# EAGLE design box (EAGLE 8.3.1)
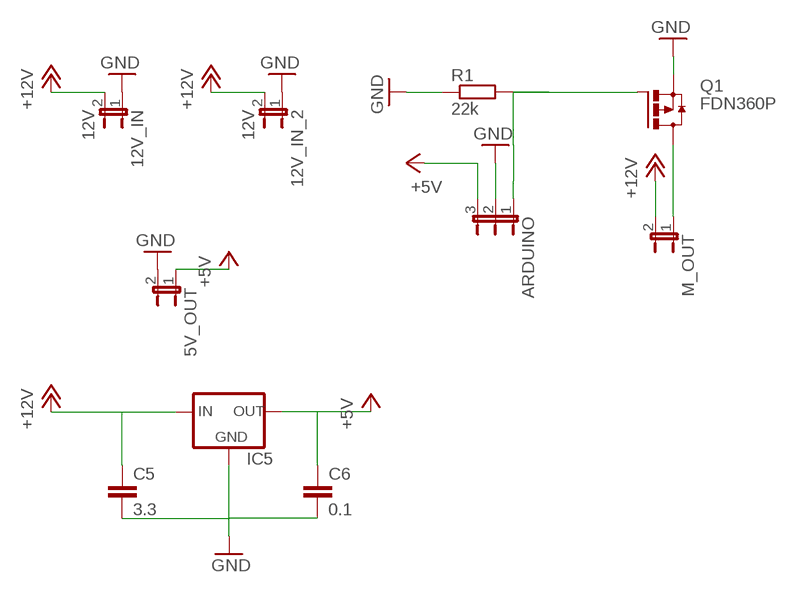
[diagram p0: schematic, sheet 1]

## Parts
5V_OUT  JP1E  [JP1]
12V_IN  12V  JP1E  [JP1]
12V_IN_2  12V  JP1E  [JP1]
ARDUINO  JP2E  [JP2]
C5  3.3  C-EU025-024X044  [C025-024X044]
C6  0.1  C-EU025-024X044  [C025-024X044]
IC5  78XXL  [78XXL]
M_OUT  JP1E  [JP1]
Q1  FDN360P  [SUPER-SOT3]
R1  22k  R-EU_0204/7  [0204/7]

## Nets
+5V: 5V_OUT.1 ARDUINO.3 C6.1 IC5.OUT
+12V: 12V_IN.2 12V_IN_2.2 C5.1 IC5.IN M_OUT.2
GND: 5V_OUT.2 12V_IN.1 12V_IN_2.1 ARDUINO.2 C5.2 C6.2 IC5.GND Q1.2(S) R1.1
N$1: M_OUT.1 Q1.3(D)
N$2: ARDUINO.1 Q1.1(G) R1.2

## Library data of the parts
5V_OUT 12V_IN 12V_IN_2 M_OUT = jumper:JP1E: JUMPER
ARDUINO = jumper:JP2E: JUMPER
C5 C6 = rcl:C-EU: CAPACITOR, European symbol
IC5 = v-reg:78XXL: VOLTAGE REGULATOR
Q1 = transistor-power:FDN360P: Single P-Channel, PowerTrench (R) MOSFET Source: http://www.fairchildsemi.com/ds/FD/FDN360P.pdf
R1 = rcl:R-EU_: RESISTOR, European symbol

## Net classes
0 default: clearance 0.205 mm

## Board
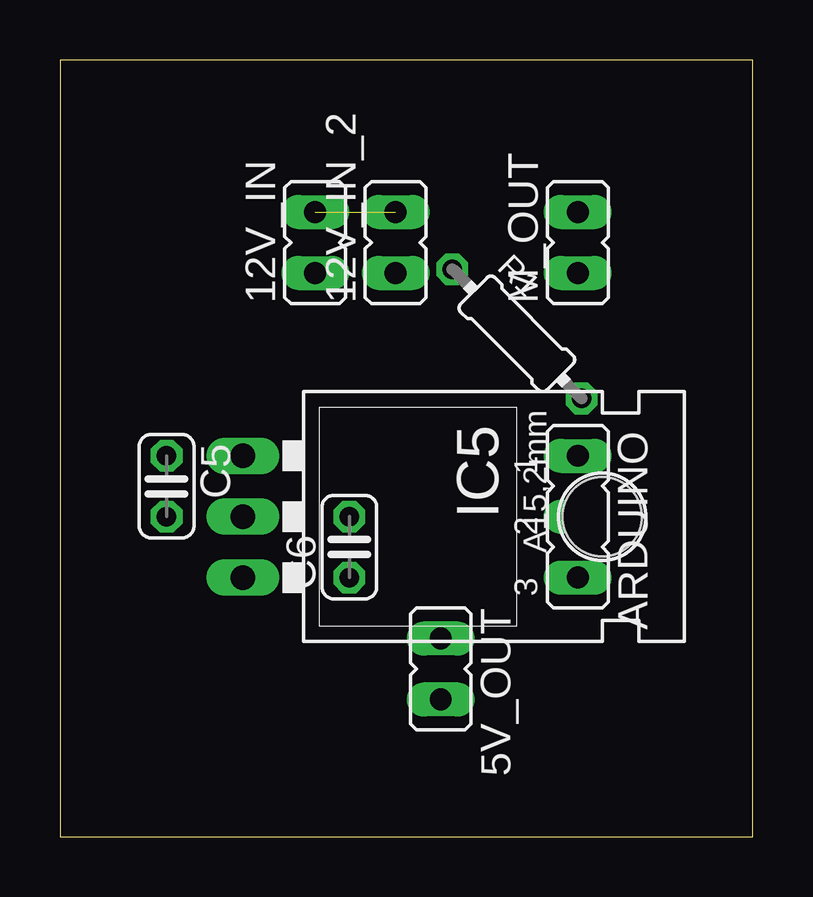
[diagram p1: board, top side]
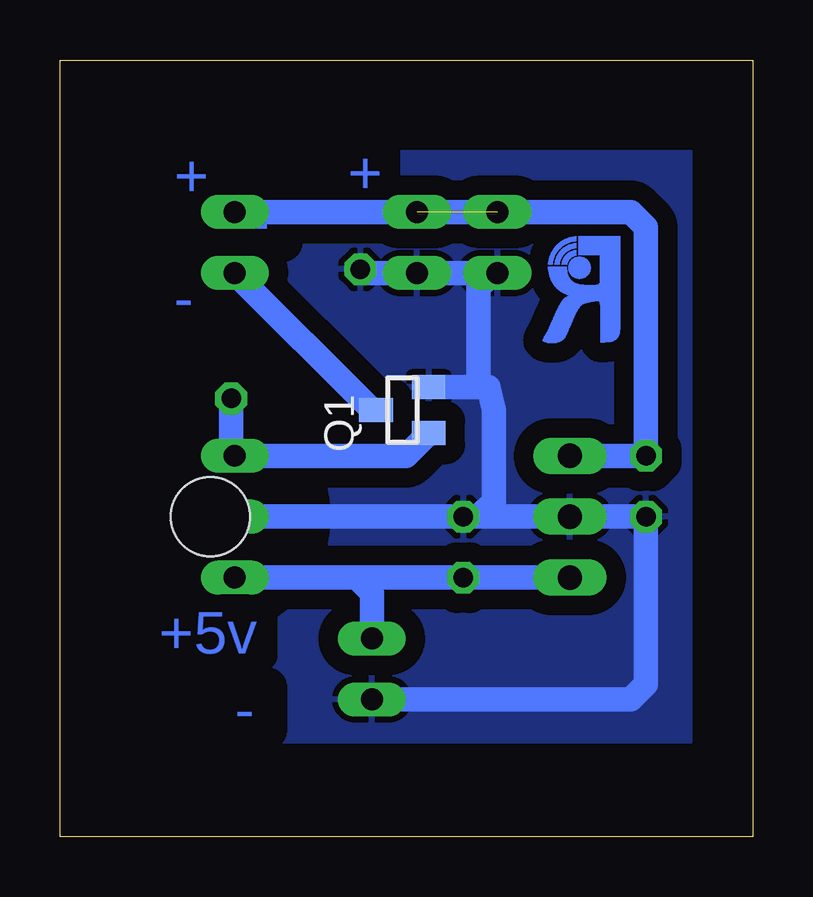
[diagram p2: board, bottom side, seen from below]

Size 28.88 x 32.38 mm. Coordinates in mm from the lower left corner, seen from the top.
Outline: 0,0 28.88,0 28.88,32.38 0,32.38 0,0
Copper layers (1*16): Top 0.035mm / dielectric 1.5mm / Bottom 0.035mm
Design rules "default": minimum track width 10mil, minimum drill 24mil, track to track 8mil, track to pad 8mil, pad to pad 8mil, via to via 8mil, smd to smd 8mil, copper to edge 40mil, drill to drill 8mil, minimum pad ring 10mil, minimum via ring 8mil, stop-mask expansion 4mil, vias tented up to drill 0mil, thermal gap 10mil

### Footprints (pad centres in the part's own frame; a part is rotated, then mirrored left to right if it is on the bottom)
JP1 = drill 0.914 long: 1 0,-1.27; 2 0,1.27
JP2 = drill 0.914 long: 1 -2.54,0; 2 0,0; 3 2.54,0
C025-024X044 = drill 0.813 octagon: 1 -1.27,0; 2 1.27,0
78XXL = drill 1.016 long: GND 0,-3.81; IN -2.54,-3.81; OUT 2.54,-3.81 | hole 3.302: 0,11.176
SUPER-SOT3 = smd 1 x 1.4: 1 -0.95,-1.1; 2 0.95,-1.1; 3 0,1.1
0204/7 = drill 0.813 octagon: 1 -3.81,0; 2 3.81,0

### Placement (x,y rotation side)
5V_OUT  15.87,6.99 180 top
12V_IN  10.64,24.77 0 top
12V_IN_2  14,24.77 0 top
ARDUINO  21.59,13.33 270 top
C5  4.45,14.6 270 top
C6  12.06,12.06 90 top
IC5  11.43,13.33 270 top
M_OUT  21.59,24.77 0 top
Q1  14.6,17.78 90 bottom
R1  19.05,20.96 315 top

### Tracks (layer width: path | path; a pad name or v marks a point on that pad's centre or on a via)
+5V
  Bottom 1.016: IC5.OUT C6.1 16.51,10.79 | ARDUINO.3 16.51,10.79 | 5V_OUT.1 15.87,10.16 16.51,10.79
+12V  (1 unrouted)
  Bottom 1.016: M_OUT.2 12V_IN.2 5.08,26.04 4.45,25.4 C5.1 IC5.IN
GND
  Bottom 1.016: ARDUINO.2 C6.2 | 11.43,18.74 11.02,18.74 10.79,17.78 10.79,13.97 11.43,13.33 C6.2 | 11.43,18.74 Q1.2 | C6.2 IC5.GND C5.2 4.45,6.35 5.08,5.71 5V_OUT.2 | 10.82,23.5 12V_IN.1 | 10.82,23.5 12V_IN_2.1 16.2,23.5 R1.1 | 11.43,18.74 11.43,22.89 10.82,23.5
  pour Bottom (isolate 0.813): 2.54,28.58 24.13,28.58 24.13,3.94 2.54,3.94
N$1
  Bottom 1.016: Q1.3 15.87,17.78 M_OUT.1
N$2
  Bottom 1.016: Q1.1 14.46,15.88 ARDUINO.1 21.74,16.03 R1.2
(copper drawn outside any net)
  shapes: Bottom area x682

### Text on the board
Bottom: + | + | - | - | - | +5v | -